# Altium project bms.PrjPcb
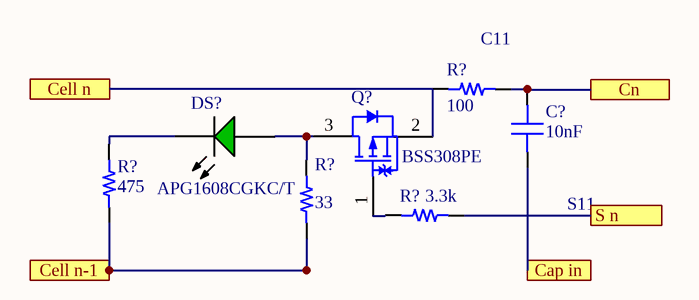
[diagram p0: discharge.SchDoc]
1 sheet, 7 parts. Net scope: flat (ports and power ports of the same name join across sheets).

## Sheet discharge.SchDoc
size A

### Parts
(Parts that share a designator on the sheet are numbered #1, #2 ... from top to bottom, then left to right.)
C?  capacitance: 10nF  [0603]  (hidden comment: capacitor)
DS?  APG1608CGKC/T  [KING-LED0603-25-GREEN_V]
Q?  BSS308PE  [INF-PG-SOT23_L]
R?#1  resistance: 100  [0603]  (hidden comment: resistor)
R?#2  resistance: 33  [0603]  (hidden comment: resistor)
R?#3  resistance: 3.3k  [0603]  (hidden comment: resistor)
R?#4  resistance: 475  [0603]  (hidden comment: resistor)

### Ports
Cap in, Cell n, Cell n-1, Cn, S n

### Nets
NetC?_1: C?.1 ; port Cap in
NetC?_2: C?.2 R?#1.1 ; port Cn
NetDS?_1: DS?.1(A) Q?.3(DRAIN) R?#2.1
NetDS?_2: DS?.2(K) R?#4.2
NetQ?_1: Q?.1(GATE) R?#3.1
NetQ?_2: Q?.2(SOURCE) R?#1.2 ; port Cell n
NetR?#2_2: R?#2.2 R?#4.1 ; port Cell n-1
NetR?#3_2: R?#3.2 ; port S n

### Notes on the sheet
- C11
- (near C?) S11

### Library data of the parts
C? = 1: Generic 0603 capacitor; id: 1; voltage: 50; dielectric: Ceramic; percent tolerance: 10; name: 0603 Capacitor; ESR: 1; package: 0603; quantity: 0
DS? = 20: LED GREEN CLEAR CHIP SMD; Forward Current: 30 mA; Reverse Voltage: 5 V; Power Dissipation: 78 mW; Packing: Reel; id: 20; vr: 5; ComponentLink1Description: Manufacturer URL; ComponentLink1URL: http://www.kingbrightusa.com/; ComponentLink2URL: http://www.kingbrightusa.com/images/catalog/SPEC/APG1608CGKC-T.pdf; Mounting Technology: Surface Mount; Storage Temperature: -40 to 85 degC; DatasheetVersion: Rev. 5B, 10/2012; PartNumber: APG1608CGKC/T; PackageReference: LED0603-25-GREEN; ComponentLink2Description: Datasheet; PackageDescription: 2-Pin SMT LED, 1.6 x 0.8 mm Body, 0.25mm Thickness; PackageVersion: Rev. 5B, 10/2012; name: APG1608CGKC/T; package: CT; quantity: 0; link: http://www.kingbrightusa.com/images/catalog/SPEC/APG1608CGKC-T.pdf; createdby: J.Childers
Q? = 12: OptiMOS™ P3 Small-Signal-Transistor; Manufacturer: Infineon; RDS (on) (max) (@4.5V): 130Â mOhm; Pto t (max): 0.5Â W; ID (max): -2Â A; IDpuls (max): -8Â A; Packing: Reel; VDS (max): -30Â V; VGS(th) (min): -2Â V; Green: TRUE; RDS (on) (max): 80Â mOhm; QG: -5Â nC; Rth: 250Â K/W; VGS(th) (max): -1Â V; id: 12; type: P-Channel; ic: -2; PartNumber: BSS308PE; ComponentLink3Description: Package Specification; PackageDescription: 3-Pin Small Outline Transistor Package, 2.9 x 1.3 mm Body, 0.95 mm Pitch; Mounting Technology: Surface Mount; PackageReference: PG-SOT23; PackageVersion: Apr-08; Halogen-free: TRUE; DatasheetVersion: Rev. 2.03; ComponentLink2URL: http://www.infineon.com/dgdl/BSS308PE_Rev23_.pdf?folderId=db3a304314dca38901154a72e3951a65&fileId=db3a304330f686060131099c80400073; ComponentLink2Description: Datasheet; ComponentLink1Description: Manufacturer URL; ComponentLink1URL: http://www.infineon.com/; ComponentLink3URL: http://www.infineon.com/dgdl/SOT23-Package_Overview.pdf?folderId=db3a30431936bc4b0119532290053c66&fileId=db3a30431936bc4b0119533468123c85; name: BSS308PE; package: PG-SOT23; quantity: 0; link: https://www.infineon.com/dgdl/BSS308PE_Rev23_.pdf?folderId=db3a304314dca38901154a72e3951a65&fileId=db3a304330f686060131099c80400073; createdby: J.Childers; createddate: 10/6/2019 5:23:00 AM
R?#1-R?#4 = 1: id: 1; name: 0603 Resistor; percent tolerance: 5; package: 0603; quantity: 0